# EAGLE schematic Line Follower (EAGLE 7.6.0)
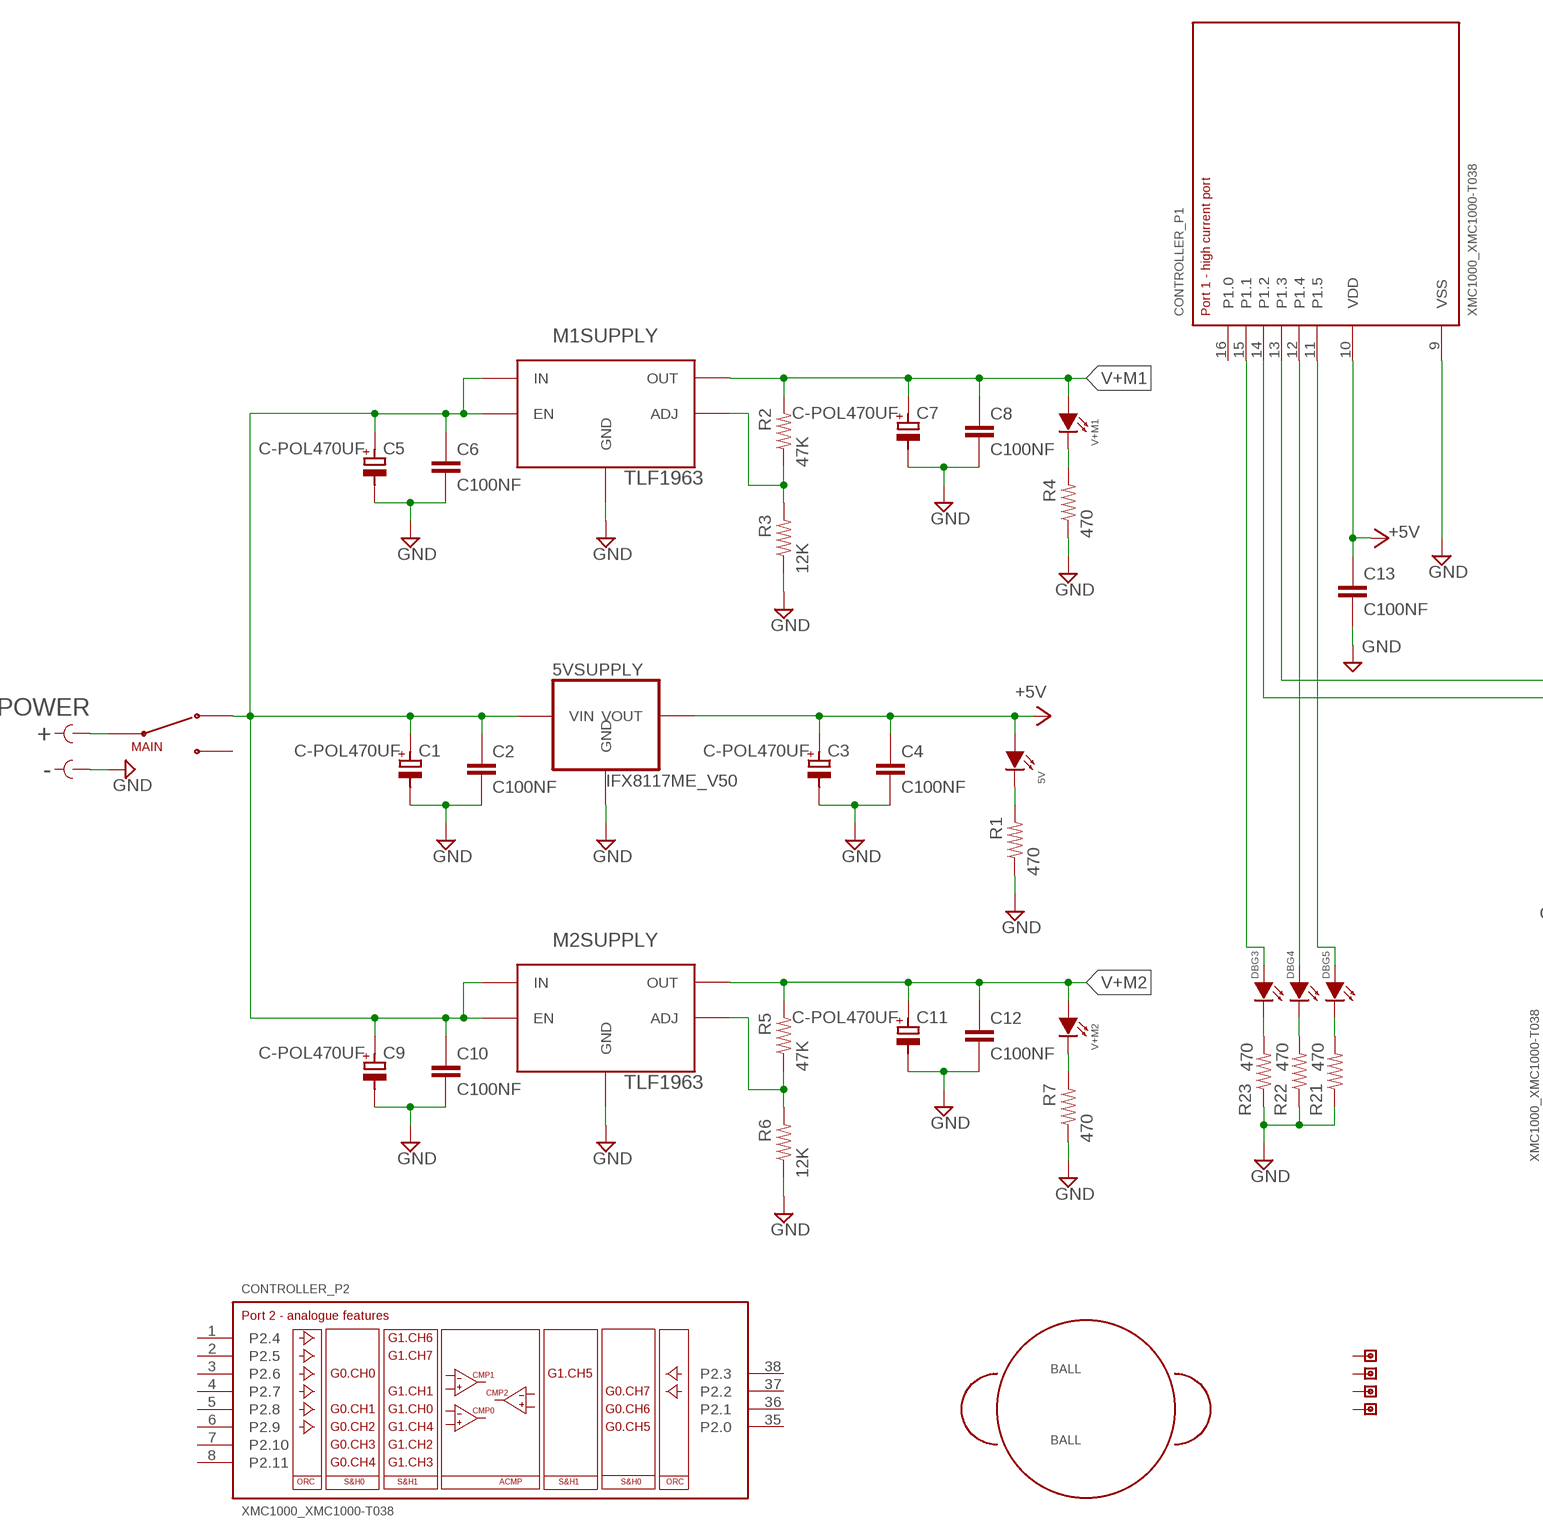
[diagram p0: schematic, sheet 1, part 1 of 2]
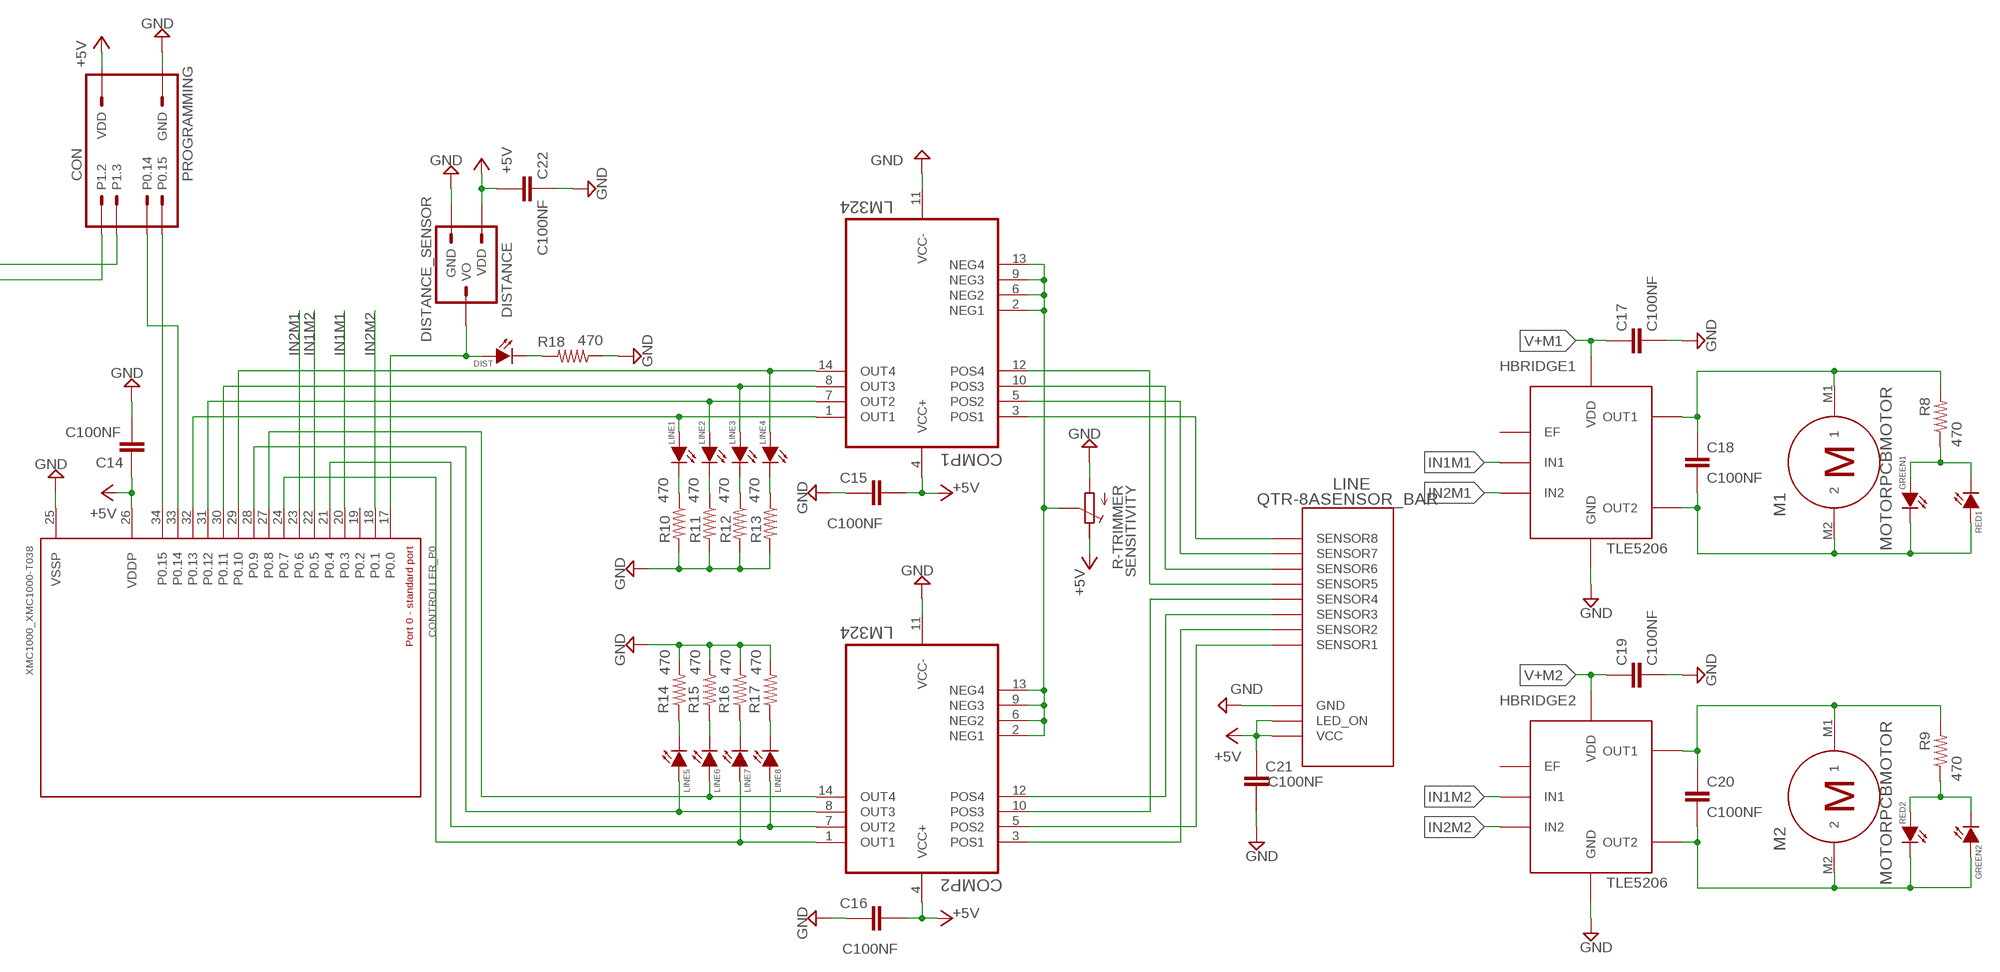
[diagram p1: schematic, sheet 1, part 2 of 2]

## Parts
5V  LED  [CHIPLED_1206]
5VSUPPLY  IFX8117ME_V50  [INF-PG-SOT223_SC-73_M_1PRIMARY]
BALL  BALL  [BALL]
C1  C-POL470UF  [E3,5-8]
C2  C100NF  [C1206]
C3  C-POL470UF  [E3,5-8]
C4  C100NF  [C1206]
C5  C-POL470UF  [E3,5-8]
C6  C100NF  [C1206]
C7  C-POL470UF  [E3,5-8]
C8  C100NF  [C1206]
C9  C-POL470UF  [E3,5-8]
C10  C100NF  [C1206]
C11  C-POL470UF  [E3,5-8]
C12  C100NF  [C1206]
C13  C100NF  [C1206]
C14  C100NF  [C1206]
C15  C100NF  [C1206]
C16  C100NF  [C1206]
C17  C100NF  [C1206]
C18  C100NF  [C1206]
C19  C100NF  [C1206]
C20  C100NF  [C1206]
C21  C100NF  [C1206]
C22  C100NF  [C1206]
COMP1  LM324  [SO14]
COMP2  LM324  [SO14]
CON  PROGRAMMING  [MA05-2]
CONTROLLER  XMC1000_XMC1000-T038  [XMC1000_P-TSSOP38-9]
DBG3  LED  [CHIPLED_1206]
DBG4  LED  [CHIPLED_1206]
DBG5  LED  [CHIPLED_1206]
DIST  LED  [CHIPLED_1206]
DISTANCE  DISTANCE_SENSOR  [MA03-2]
GREEN1  LED  [CHIPLED_1206]
GREEN2  LED  [CHIPLED_1206]
HBRIDGE1  TLE5206  [INF-PG-TO263-7-1_L_1PRIMARY]
HBRIDGE2  TLE5206  [INF-PG-TO263-7-1_L_1PRIMARY]
LINE  QTR-8ASENSOR_BAR  [QTR-8A]
LINE1  LED  [CHIPLED_1206]
LINE2  LED  [CHIPLED_1206]
LINE3  LED  [CHIPLED_1206]
LINE4  LED  [CHIPLED_1206]
LINE5  LED  [CHIPLED_1206]
LINE6  LED  [CHIPLED_1206]
LINE7  LED  [CHIPLED_1206]
LINE8  LED  [CHIPLED_1206]
M1  MOTORPCBMOTOR  [MICRO-MOTOR]
M1SUPPLY  TLF1963  [INF-PG-TO252-5-11_L_1PRIMARY]
M2  MOTORPCBMOTOR  [MICRO-MOTOR]
M2SUPPLY  TLF1963  [INF-PG-TO252-5-11_L_1PRIMARY]
MAIN  SWITCH1OFF2  [MS111]
POWER  PWRCONCON1  [PWRCON]
R1  470  R1206  [R1206]
R2  47K  R1206  [R1206]
R3  12K  R1206  [R1206]
R4  470  R1206  [R1206]
R5  47K  R1206  [R1206]
R6  12K  R1206  [R1206]
R7  470  R1206  [R1206]
R8  470  R1206  [R1206]
R9  470  R1206  [R1206]
R10  470  R1206  [R1206]
R11  470  R1206  [R1206]
R12  470  R1206  [R1206]
R13  470  R1206  [R1206]
R14  470  R1206  [R1206]
R15  470  R1206  [R1206]
R16  470  R1206  [R1206]
R17  470  R1206  [R1206]
R18  470  R1206  [R1206]
R21  470  R1206  [R1206]
R22  470  R1206  [R1206]
R23  470  R1206  [R1206]
RED1  LED  [CHIPLED_1206]
RED2  LED  [CHIPLED_1206]
SENSITIVITY  R-TRIMMER  [TRIMMER]
U$2  SPACER  [SPACERS_M3]
U$3  SPACER  [SPACERS_M3]
U$4  SPACER  [SPACERS_M3]
U$5  SPACER  [SPACERS_M3]
V+M1  LED  [CHIPLED_1206]
V+M2  LED  [CHIPLED_1206]

## Nets
+5V: 5V.A 5VSUPPLY.2(VOUT) 5VSUPPLY.4(VOUT) C3.+ C4.1 C13.1 C14.2 C15.2 C16.2 C21.1 C22.1 COMP1.4(VCC+) COMP2.4(VCC+) CON.5(VDD) CON.6(VDD) CONTROLLER.10(_P1:VDD) CONTROLLER.26(_P0:VDDP) DISTANCE.1(VDD) LINE.P$2(LED_ON) LINE.P$4(VCC) SENSITIVITY.2(E)
GND: 5VSUPPLY.1(GND) C1.- C2.2 C3.- C4.2 C5.- C6.2 C7.- C8.2 C9.- C10.2 C11.- C12.2 C13.2 C14.1 C15.1 C16.1 C17.2 C19.2 C21.2 C22.2 COMP1.11(VCC-) COMP2.11(VCC-) CON.3(GND) CON.4(GND) CON.9(GND) CON.10(GND) CONTROLLER.9(_P1:VSS) CONTROLLER.25(_P0:VSSP) DISTANCE.3(GND) DISTANCE.4(GND) DISTANCE.5(GND) DISTANCE.6(GND) HBRIDGE1.4(GND) HBRIDGE1.8(GND) HBRIDGE2.4(GND) HBRIDGE2.8(GND) LINE.P$6(GND) LINE.P$8(GND) LINE.P$10(GND) LINE.P$12(GND) LINE.P$14(GND) LINE.P$16(GND) M1SUPPLY.3(GND) M2SUPPLY.3(GND) POWER.- R1.1 R3.1 R4.1 R6.1 R7.1 R10.2 R11.2 R12.2 R13.2 R14.2 R15.2 R16.2 R17.2 R18.1 R21.1 R22.1 R23.1 SENSITIVITY.1(A)
IN1M1: CONTROLLER.20(_P0:P0.3) HBRIDGE1.3(IN1)
IN1M2: CONTROLLER.22(_P0:P0.5) HBRIDGE2.3(IN1)
IN2M1: CONTROLLER.23(_P0:P0.6) HBRIDGE1.5(IN2)
IN2M2: CONTROLLER.18(_P0:P0.1) HBRIDGE2.5(IN2)
N$1: MAIN.P$2(COM) POWER.+
N$2: C20.2 GREEN2.A HBRIDGE2.7(OUT2) M2.M2 RED2.C(K)
N$3: 5V.C(K) R1.2
N$4: CON.1(P0.15) CONTROLLER.34(_P0:P0.15)
N$5: CON.2(P0.14) CONTROLLER.33(_P0:P0.14)
N$6: CON.7(P1.3) CONTROLLER.13(_P1:P1.3)
N$7: CON.8(P1.2) CONTROLLER.14(_P1:P1.2)
N$8: COMP1.2(NEG1) COMP1.6(NEG2) COMP1.9(NEG3) COMP1.13(NEG4) COMP2.2(NEG1) COMP2.6(NEG2) COMP2.9(NEG3) COMP2.13(NEG4) SENSITIVITY.3(S)
N$9: COMP1.3(POS1) LINE.P$15(SENSOR8)
N$10: COMP1.5(POS2) LINE.P$13(SENSOR7)
N$11: COMP1.10(POS3) LINE.P$11(SENSOR6)
N$12: COMP1.12(POS4) LINE.P$9(SENSOR5)
N$13: COMP2.5(POS2) LINE.P$1(SENSOR1)
N$14: COMP2.3(POS1) LINE.P$3(SENSOR2)
N$15: COMP2.12(POS4) LINE.P$5(SENSOR3)
N$16: COMP2.10(POS3) LINE.P$7(SENSOR4)
N$17: 5VSUPPLY.3(VIN) C1.+ C2.1 C5.+ C6.1 C9.+ C10.1 M1SUPPLY.1(EN) M1SUPPLY.2(IN) M2SUPPLY.1(EN) M2SUPPLY.2(IN) MAIN.P$1
N$18: M1SUPPLY.5(ADJ) R2.1 R3.2
N$19: R4.2 V+M1.C(K)
N$20: M2SUPPLY.5(ADJ) R5.1 R6.2
N$21: R7.2 V+M2.C(K)
N$22: GREEN1.A R8.1 RED1.C(K)
N$23: C18.2 GREEN1.C(K) HBRIDGE1.7(OUT2) M1.M2 RED1.A
N$24: C18.1 HBRIDGE1.1(OUT1) M1.M1 R8.2
N$25: C20.1 HBRIDGE2.1(OUT1) M2.M1 R9.2
N$26: CONTROLLER.12(_P1:P1.4) DBG4.A
N$27: COMP1.14(OUT4) CONTROLLER.29(_P0:P0.10) LINE4.A
N$28: COMP1.8(OUT3) CONTROLLER.30(_P0:P0.11) LINE3.A
N$29: COMP1.7(OUT2) CONTROLLER.31(_P0:P0.12) LINE2.A
N$30: COMP1.1(OUT1) CONTROLLER.32(_P0:P0.13) LINE1.A
N$31: COMP2.1(OUT1) CONTROLLER.24(_P0:P0.7) LINE7.A
N$32: COMP2.7(OUT2) CONTROLLER.21(_P0:P0.4) LINE8.A
N$33: COMP2.8(OUT3) CONTROLLER.28(_P0:P0.9) LINE5.A
N$34: COMP2.14(OUT4) CONTROLLER.27(_P0:P0.8) LINE6.A
N$35: CONTROLLER.17(_P0:P0.0) DIST.A DISTANCE.2(VO)
N$37: LINE1.C(K) R10.1
N$39: LINE2.C(K) R11.1
N$40: LINE3.C(K) R12.1
N$41: LINE4.C(K) R13.1
N$42: LINE5.C(K) R14.1
N$43: LINE6.C(K) R15.1
N$44: LINE7.C(K) R16.1
N$45: LINE8.C(K) R17.1
N$46: DIST.C(K) R18.2
N$51: CONTROLLER.15(_P1:P1.1) DBG3.A
N$52: CONTROLLER.11(_P1:P1.5) DBG5.A
N$54: DBG5.C(K) R21.2
N$55: DBG4.C(K) R22.2
N$56: DBG3.C(K) R23.2
N$58: GREEN2.C(K) R9.1 RED2.A
V+M1: C7.+ C8.1 C17.1 HBRIDGE1.6(VDD) M1SUPPLY.4(OUT) R2.2 V+M1.A
V+M2: C11.+ C12.1 C19.1 HBRIDGE2.6(VDD) M2SUPPLY.4(OUT) R5.2 V+M2.A
Unconnected: CONTROLLER.1(_P2:P2.4) CONTROLLER.2(_P2:P2.5) CONTROLLER.3(_P2:P2.6) CONTROLLER.4(_P2:P2.7) CONTROLLER.5(_P2:P2.8) CONTROLLER.6(_P2:P2.9) CONTROLLER.7(_P2:P2.10) CONTROLLER.8(_P2:P2.11) CONTROLLER.16(_P1:P1.0) CONTROLLER.19(_P0:P0.2) CONTROLLER.35(_P2:P2.0) CONTROLLER.36(_P2:P2.1) CONTROLLER.37(_P2:P2.2) CONTROLLER.38(_P2:P2.3) HBRIDGE1.2(EF) HBRIDGE2.2(EF) MAIN.P$3 U$2.P$1 U$3.P$1 U$4.P$1 U$5.P$1

## Library data of the parts
5V DBG3-DBG5 DIST GREEN1 GREEN2 LINE1-LINE8 RED1 RED2 V+M1 V+M2 = Line_Follower_LIBV2.1:LED
5VSUPPLY = Line_Follower_LIBV2.1:IFX8117ME_V50
BALL = Line_Follower_LIBV2.1:BALL
C1 C3 C5 C7 C9 C11 = Line_Follower_LIBV2.1:C-POL
C2 C4 C6 C8 C10 C12-C22 = Line_Follower_LIBV2.1:C
COMP1 COMP2 = Line_Follower_LIBV2.1:LM324
CON = Line_Follower_LIBV2.1:PROGRAMMING
CONTROLLER = Line_Follower_LIBV2.1:XMC1000_XMC1000-T038
DISTANCE = Line_Follower_LIBV2.1:DISTANCE_SENSOR
HBRIDGE1 HBRIDGE2 = Line_Follower_LIBV2.1:TLE5206
LINE = Line_Follower_LIBV2.1:QTR-8A
M1 M2 = Line_Follower_LIBV2.1:MOTOR
M1SUPPLY M2SUPPLY = Line_Follower_LIBV2.1:TLF1963
MAIN = Line_Follower_LIBV2.1:SWITCH1OFF2
POWER = Line_Follower_LIBV2.1:PWRCON
R1-R18 R21-R23 = Line_Follower_LIBV2.1:R
SENSITIVITY = Line_Follower_LIBV2.1:R-TRIMMER
U$2-U$5 = Line_Follower_LIBV2.1:SPACER